# EAGLE schematic Potions_Cabinet (EAGLE 9.6.2)
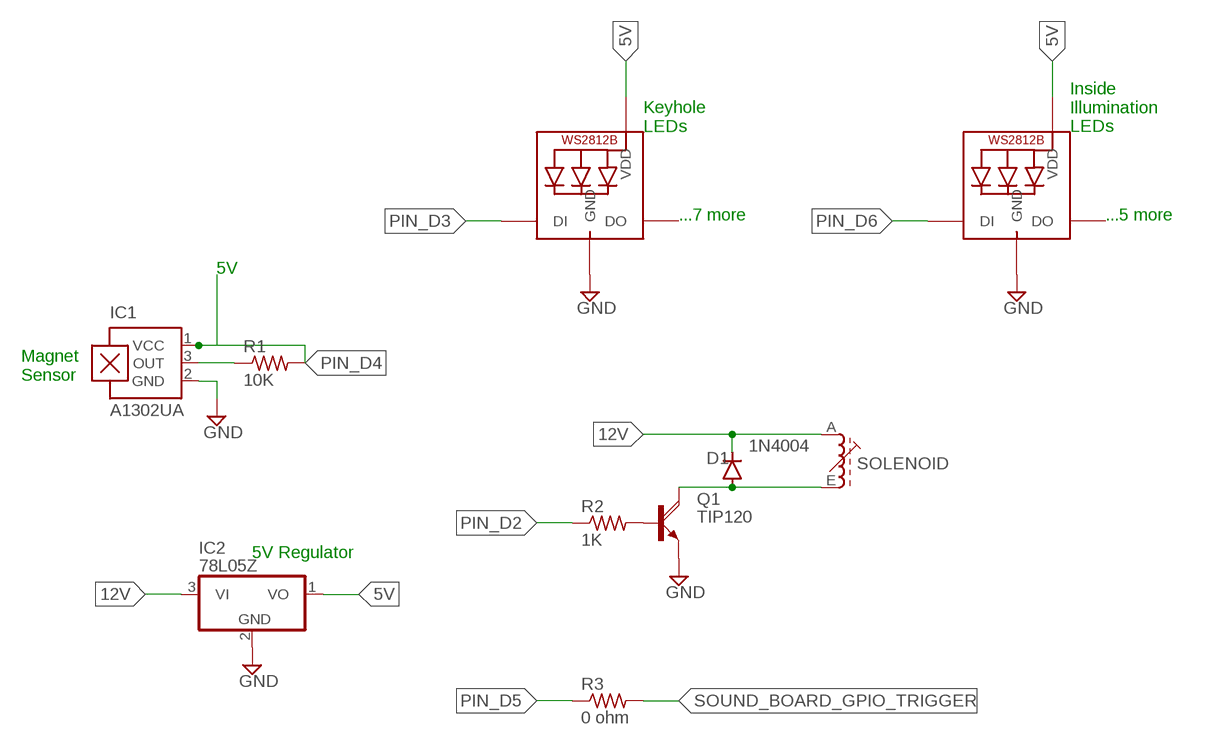
[diagram p0: schematic, sheet 1]

## Parts
D1  1N4004  [DO41-10]
IC1  A1302UA  [SIP3-UA]
IC2  78L05Z  [TO92]
LED1  WS2812B3535  [LED3535]
LED2  WS2812B3535  [LED3535]
Q1  TIP120  [TO220AH]
R1  10K  R-US_0204/7  [0204/7]
R2  1K  R-US_0204/7  [0204/7]
R3  0 ohm  R-US_0204/7  [0204/7]
SOLENOID  71E  [71E]

## Nets
5V: IC2.1(VO) LED1.2(VDD) LED2.2(VDD)
12V: D1.C IC2.3(VI) SOLENOID.A
GND: IC1.2(GND) IC2.2(GND) LED1.4(GND) LED2.4(GND) Q1.E
N$1: IC1.3(OUT) R1.1
N$2: Q1.B R2.2
N$4: D1.A Q1.C SOLENOID.E
PIN_D2: R2.1
PIN_D3: LED1.1(DI)
PIN_D4: IC1.1(VCC) R1.2
PIN_D5: R3.1
PIN_D6: LED2.1(DI)
SOUND_BOARD_GPIO_TRIGGER: R3.2
Unconnected: LED1.3(DO) LED2.3(DO) SOLENOID.S1 SOLENOID.S2

## Notes on the sheet
- Keyhole
  LEDs
- Inside
  Illumination
  LEDs
- ...7 more | ...5 more
- 5V
- Magnet
  Sensor
- 5V Regulator

## Library data of the parts
D1 = diode:1N4004: DIODE general purpose rectifier, 1 A
IC1 = allegro:A13*?: Linear Hall Effect Sensor ICs Continuous-Time Ratiometric High-Temperature Operation Programmable Linear with Analog Output A1302 -Replacement- UGN3503 Source: http://www.allegromicro.com/en/Products/Part_Numbers/1301/1301.pdf http://www.allegromicro.com/en/Products/Part_Numbers/1321/1321.pdf http://www.allegromicro.com/en/Products/Part_Numbers/1381/1381.pdf; MF: ALLEGRO MICROSYSTEMS, INC.; MPN: A1302EUA-T; OC_FARNELL: 1521708; OC_NEWARK: 31K6639
IC2 = adafruit:78*: Positive VOLTAGE REGULATOR Added bigger pads to the TO-92 package
LED1 LED2 = adafruit:WS2812B
Q1 = transistor-power:TIP120: NPN DARLINGTON TRANSISTOR
R1-R3 = rcl:R-US_: RESISTOR, American symbol; SPICEPREFIX: R
SOLENOID = inductor-neosid:71E: FILTER adjustable filter coil, Type E; OC_FARNELL: unknown; OC_NEWARK: unknown